# EAGLE design allegro bob (EAGLE 5.07)
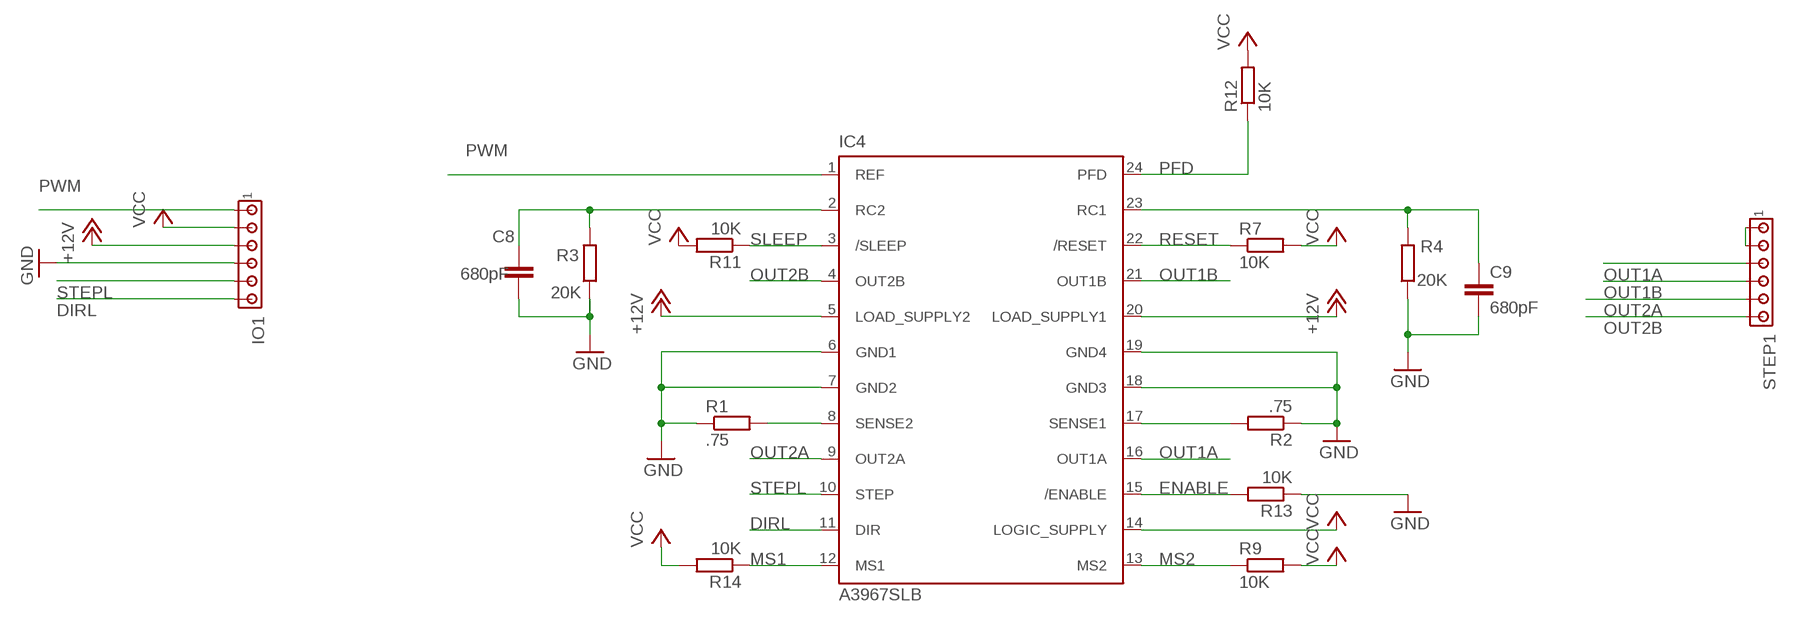
[diagram p0: schematic, sheet 1]

## Parts
C8  680pF  C-EUC1206  [C1206]
C9  680pF  C-EUC1206  [C1206]
IC4  A3967SLB  [SO24W]
IO1  MTA06-100  [10X06MTA]
R1  .75  R-EU_R1206  [R1206]
R2  .75  R-EU_R1206  [R1206]
R3  20K  R-EU_R1206  [R1206]
R4  20K  R-EU_R1206  [R1206]
R7  10K  R-EU_R1206  [R1206]
R9  10K  R-EU_R1206  [R1206]
R11  10K  R-EU_R1206  [R1206]
R12  10K  R-EU_R1206  [R1206]
R13  10K  R-EU_R1206  [R1206]
R14  10K  R-EU_R1206  [R1206]
STEP1  MTA06-100  [10X06MTA]

## Nets
+12V [power]: IC4.5(LOAD_SUPPLY2) IC4.20(LOAD_SUPPLY1) IO1.4
DIRL: IC4.11(DIR) IO1.1
ENABLE: IC4.15(/ENABLE) R13.2
GND: C8.2 C9.2 IC4.6(GND1) IC4.7(GND2) IC4.18(GND3) IC4.19(GND4) IO1.3 R1.1 R2.1 R3.1 R4.1 R13.1
MOTORSUPPLY [power]: STEP1.5 STEP1.6
MS1: IC4.12(MS1) R14.1
MS2: IC4.13(MS2) R9.1
N$3: IC4.8(SENSE2) R1.2
N$14: IC4.17(SENSE1) R2.2
N$16: C8.1 IC4.2(RC2) R3.2
N$20: C9.1 IC4.23(RC1) R4.2
OUT1A: IC4.16(OUT1A) STEP1.4
OUT1B: IC4.21(OUT1B) STEP1.3
OUT2A: IC4.9(OUT2A) STEP1.2
OUT2B: IC4.4(OUT2B) STEP1.1
PFD: IC4.24(PFD) R12.1
PWM: IC4.1(REF) IO1.6
RESET: IC4.22(/RESET) R7.1
SLEEP: IC4.3(/SLEEP) R11.1
STEPL: IC4.10(STEP) IO1.2
VCC: IC4.14(LOGIC_SUPPLY) IO1.5 R7.2 R9.2 R11.2 R12.2 R14.2

## Library data of the parts
C8 C9 = matt rcl:C-EU: CAPACITOR, European symbol
IC4 = Allegro:A3967SLB: ANALOG DEVICES
IO1 STEP1 = matt con-amp:MTA06-100: AMP connector
R1-R4 R7 R9 R11-R14 = matt rcl:R-EU_: RESISTOR, European symbol

## Net classes
1 power: width 2 mm

## Board
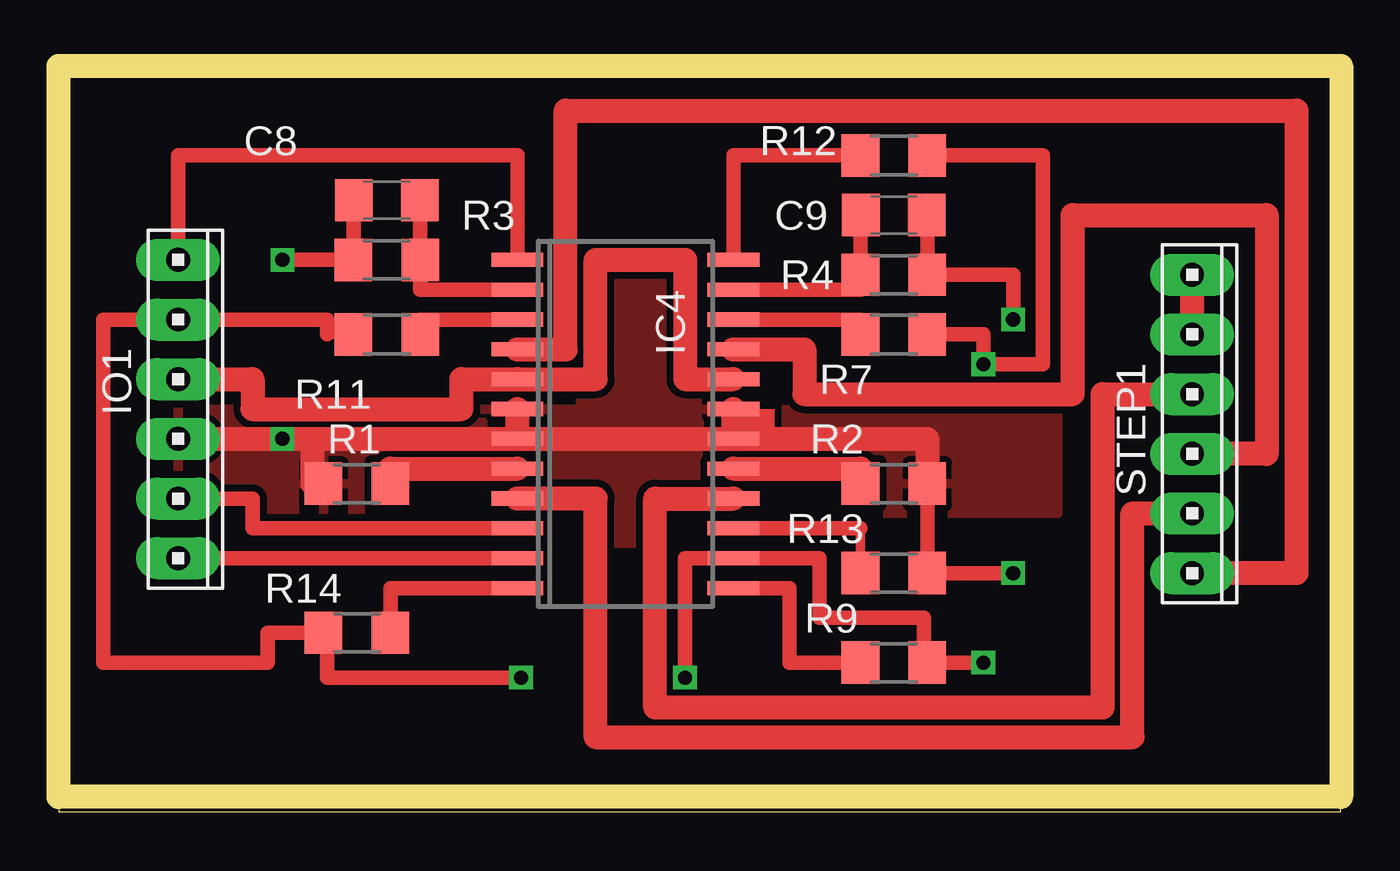
[diagram p1: board, top side]
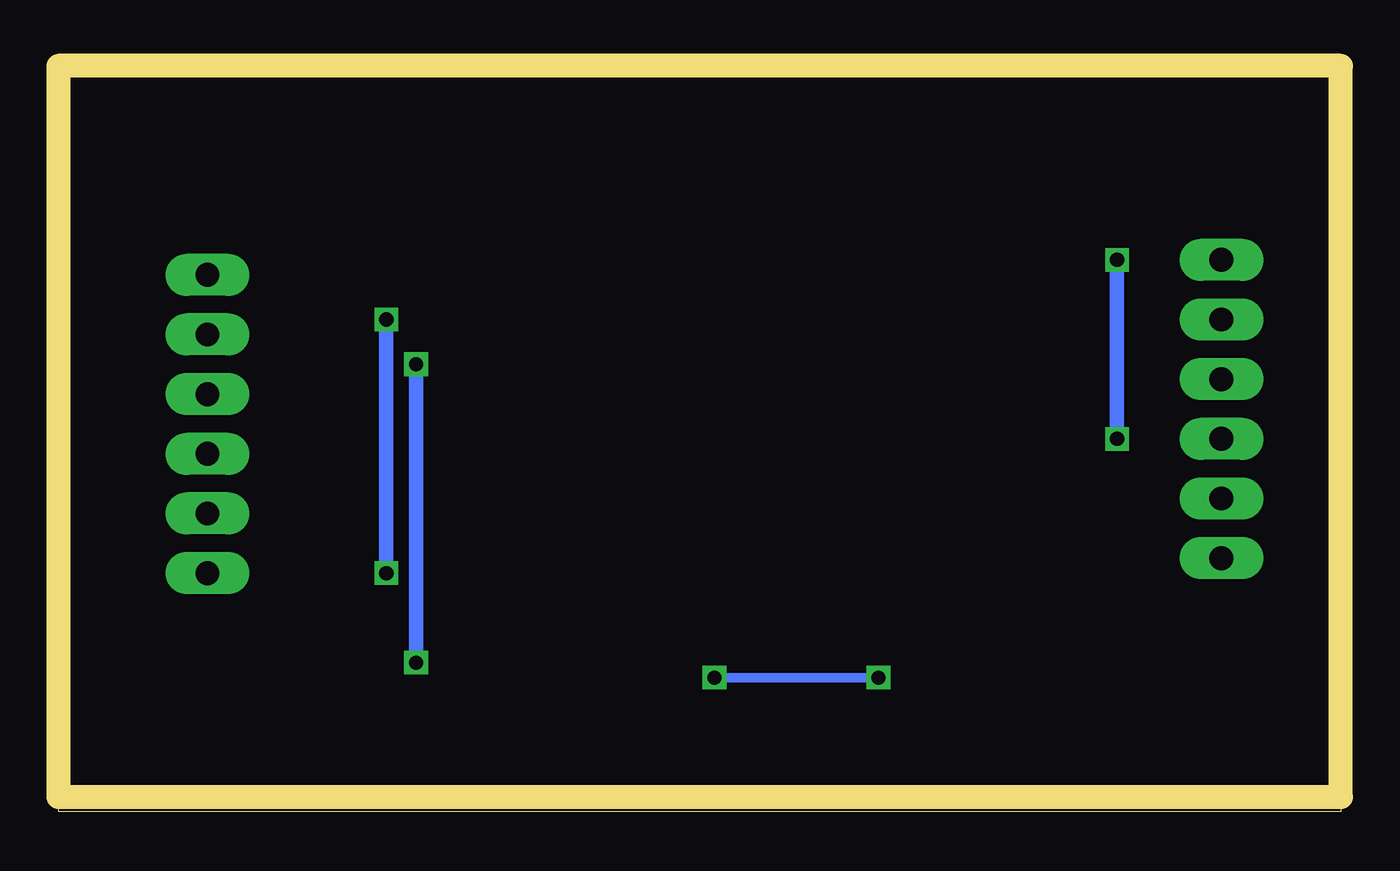
[diagram p2: board, bottom side, seen from below]

Size 54.59 x 32.05 mm. Coordinates in mm from the lower left corner, seen from the top.
Outline: 0,0 54.59,0 54.59,32.05 0,32.05 0,0
Copper layers (1*16): Top 0.035mm / dielectric 1.5mm / Bottom 0.035mm
Design rules "default": minimum track width 10mil, minimum drill 24mil, track to track 8mil, track to pad 8mil, pad to pad 8mil, via to via 8mil, smd to smd 8mil, copper to edge 40mil, drill to drill 8mil, minimum pad ring 10mil, minimum via ring 8mil, stop-mask expansion 4mil, vias tented up to drill 0mil, thermal gap 10mil
Milling: 4 lines

### Footprints (pad centres in the part's own frame; a part is rotated, then mirrored left to right if it is on the bottom)
C1206 = smd 1.6 x 1.8: 1 -1.4,0; 2 1.4,0
SO24W = smd 0.6 x 2.2: 1 -6.985,-4.6; 2 -5.715,-4.6; 3 -4.445,-4.6; 4 -3.175,-4.6; 5 -1.905,-4.6; 6 -0.635,-4.6; 7 0.635,-4.6; 8 1.905,-4.6; 9 3.175,-4.6; 10 4.445,-4.6; 11 5.715,-4.6; 12 6.985,-4.6; 13 6.985,4.6; 14 5.715,4.6; 15 4.445,4.6; 16 3.175,4.6; 17 1.905,4.6; 18 0.635,4.6; 19 -0.635,4.6; 20 -1.905,4.6; 21 -3.175,4.6; 22 -4.445,4.6; 23 -5.715,4.6; 24 -6.985,4.6
10X06MTA = drill 1.016 pad 1.778 long: 1 6.35,0; 2 3.81,0; 3 1.27,0; 4 -1.27,0; 5 -3.81,0; 6 -6.35,0
R1206 = smd 1.6 x 1.803: 1 -1.422,0; 2 1.422,0

### Placement (x,y rotation side)
C8  13.97,26.04 180 top
C9  35.56,25.4 0 top
IC4  24.13,16.51 270 top
IO1  5.08,17.14 270 top
R1  12.7,13.97 0 top
R2  35.56,13.97 180 top
R3  13.97,23.5 0 top
R4  35.56,22.86 180 top
R7  35.56,20.32 0 top
R9  35.56,6.35 0 top
R11  13.97,20.32 180 top
R12  35.56,27.94 0 top
R13  35.56,10.16 180 top
R14  12.7,7.62 180 top
STEP1  48.26,16.51 270 top

### Tracks (layer width: path | path; a pad name or v marks a point on that pad's centre or on a via)
+12V
  Top 1.016: IO1.4 8.26,18.41 8.26,17.14 17.14,17.14 17.14,18.41 IC4.5 22.86,18.41 22.86,23.5 26.67,23.5 26.67,18.41 IC4.20
DIRL
  Top 0.61: IO1.1 IC4.11
ENABLE
  Top 0.406: 34.14,12.06 R13.2
  Top 0.61: IC4.15 34.14,12.06
GND  (via drill 0.6)
  Top 0.406: R13.1 36.83,10.16 | 10.79,13.97 R1.1 | 36.98,25.4 C9.2
  Top 0.61: C8.2 12.55,24.77 R3.1 v9.53,23.5 | R2.1 R13.1 v40.64,10.16 | v40.64,20.95 40.64,22.86 R4.1 36.98,25.4
  Top 1.016: IC4.7 IC4.6 | IC4.18 IC4.19 | IC4.7 IC4.18 | IC4.18 36.98,15.88 R2.1 | IO1.3 v9.53,15.88 10.79,15.88 | 10.79,15.88 IC4.7 | 10.79,15.88 10.79,13.97
  Bottom 0.61: v40.64,10.16 v40.64,20.95 | v9.53,15.88 v9.53,23.5
  pour Top (isolate 0.305): 4.45,17.14 22.22,17.14 22.22,24.13 29.21,24.13 29.21,17.14 42.55,17.14 42.55,12.7 26.67,12.7 26.04,11.43 4.45,11.43
MOTORSUPPLY
  Top 1.016: STEP1.5 STEP1.6
MS1
  Top 0.61: IC4.12 14.12,9.53 R14.1
MS2
  Top 0.61: IC4.13 31.11,9.53 31.11,6.35 R9.1
N$3
  Top 0.406: R1.2 14.12,14.61
  Top 1.016: 14.12,14.61 IC4.8
N$14
  Top 0.406: 34.29,13.97 R2.2 34.14,14.61
  Top 1.016: IC4.17 34.14,14.61
N$16
  Top 0.61: IC4.2 15.39,22.23 R3.2 15.39,24.77 C8.1
N$20
  Top 0.406: 34.14,25.4 C9.1 | 34.14,22.23 R4.2
  Top 0.61: R4.2 34.14,25.4 | IC4.23 34.14,22.23
OUT1A
  Top 1.016: IC4.16 25.4,13.34 25.4,4.45 44.45,4.45 44.45,17.78 STEP1.4
OUT1B
  Top 1.016: IC4.21 31.75,19.68 31.75,17.78 43.18,17.78 43.18,25.4 51.44,25.4 51.44,15.24 STEP1.3
OUT2A
  Top 1.016: IC4.9 22.86,13.34 22.86,3.17 45.72,3.17 45.72,12.7 STEP1.2
OUT2B
  Top 1.016: STEP1.1 52.71,10.16 52.71,29.84 21.59,29.84 21.59,19.68 IC4.4
PFD
  Top 0.61: R12.1 28.73,27.94 IC4.24
PWM
  Top 0.61: IO1.6 5.08,27.94 19.53,27.94 IC4.1
RESET
  Top 0.406: 34.14,20.95 R7.1
  Top 0.61: IC4.22 34.14,20.95
SLEEP
  Top 0.406: R11.1 15.39,20.95
  Top 0.61: 15.39,20.95 IC4.3
STEPL
  Top 0.61: IC4.10 8.26,12.06 8.26,13.34 IO1.2
VCC  (via drill 0.6)
  Top 0.406: R14.2 11.43,7.62 | 36.83,6.35 R9.2 | 11.43,20.32 R11.2
  Top 0.61: 11.43,7.62 11.43,5.71 v19.68,5.71 | 36.83,6.35 36.83,8.26 32.39,8.26 32.39,10.79 IC4.14 26.67,10.79 v26.67,5.71 | R7.2 39.37,20.32 v39.37,19.05 41.91,19.05 41.91,27.94 R12.2 | R9.2 v39.37,6.35 | R14.2 8.89,7.62 8.89,6.35 1.91,6.35 1.91,20.95 IO1.5 11.43,20.95 11.43,20.32
  Bottom 0.406: v19.68,5.71 v26.67,5.71
  Bottom 0.61: v39.37,6.35 v39.37,19.05
(copper drawn outside any net)
  shapes: Top area x2